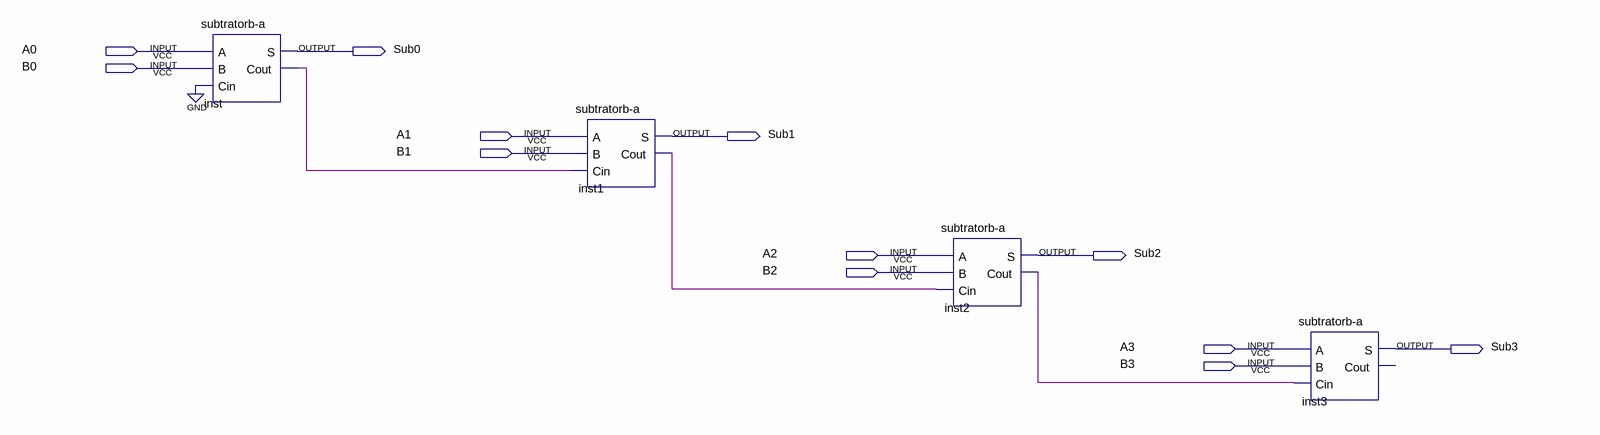
[diagram p0: schematic sheet]
// Quartus schematic subtrator4bit.bdf as structural Verilog: 4 symbols, 12 pins
module subtrator4bit (
  input  A0,
  input  B0,
  input  A1,
  input  B1,
  input  A2,
  input  B2,
  input  A3,
  input  B3,
  output Sub0,
  output Sub1,
  output Sub2,
  output Sub3
);

  wire inst1_cout, inst2_cout, inst_cout;

  \subtratorb-a  inst (.A(A0), .B(B0), .Cin(1'b0), .S(Sub0), .Cout(inst_cout));
  \subtratorb-a  inst1 (.A(A1), .B(B1), .Cin(inst_cout), .S(Sub1), .Cout(inst1_cout));
  \subtratorb-a  inst2 (.A(A2), .B(B2), .Cin(inst1_cout), .S(Sub2), .Cout(inst2_cout));
  \subtratorb-a  inst3 (.A(A3), .B(B3), .Cin(inst2_cout), .S(Sub3));  // open: Cout
endmodule
